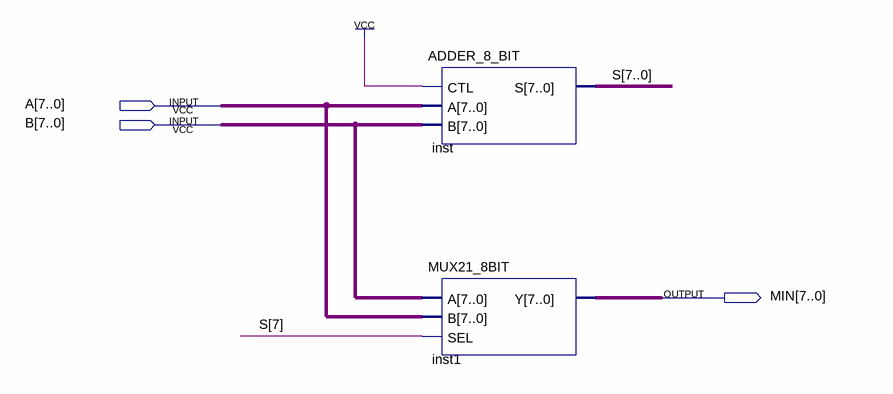
[diagram p0: schematic sheet]
// Quartus schematic MIN_UNIT.bdf as structural Verilog: 2 symbols, 3 pins
module MIN_UNIT (
  input  [7:0] A,
  input  [7:0] B,
  output [7:0] MIN
);

  wire [7:0] S;

  ADDER_8_BIT inst (.CTL(1'b1), .A(A), .B(B), .S(S));
  MUX21_8BIT inst1 (.A(B), .B(A), .SEL(S[7]), .Y(MIN));
endmodule
